# EAGLE design ethernet_poe (EAGLE 9.6.2)
REVISION: 1.0; TEAM: RoboRacing
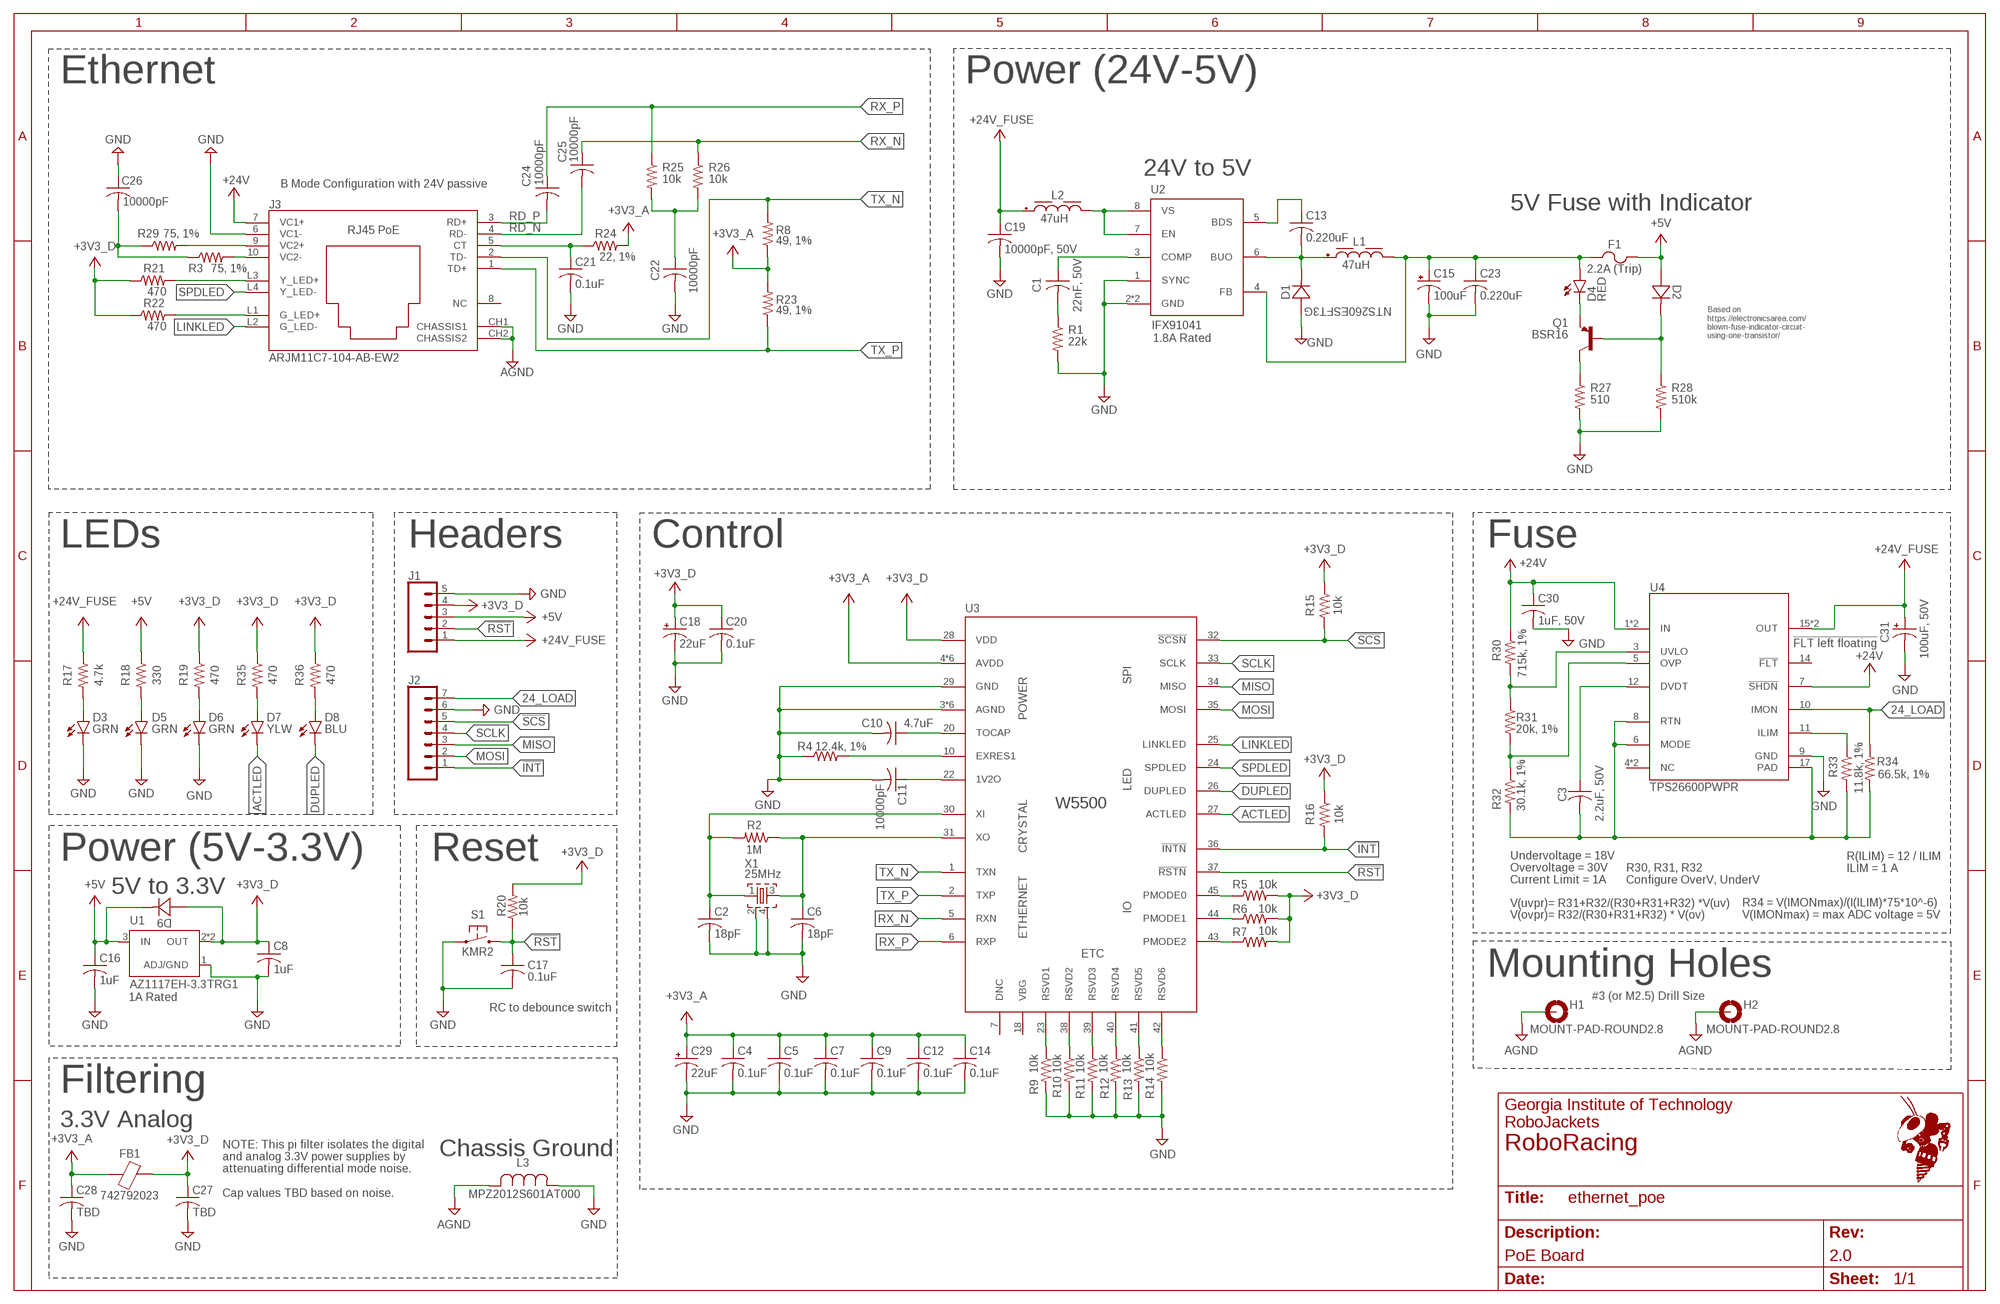
[diagram p0: schematic, sheet 1]
FRAME1 (FRAME_11_17): REVISION: 2.0; SCH_DESC: PoE Board; TEAM: RoboRacing

## Parts
C1  22nF, 50V  C-USC0603  [C0603]
C2  18pF  C-USC0603  [C0603]
C3  2.2uF, 50V  C-USC0603  [C0603]
C4  0.1uF  C-USC0402  [C0402]
C5  0.1uF  C-USC0402  [C0402]
C6  18pF  C-USC0603  [C0603]
C7  0.1uF  C-USC0402  [C0402]
C8  1uF  C-USC0603  [C0603]
C9  0.1uF  C-USC0402  [C0402]
C10  4.7uF  C-USC0603  [C0603]
C11  10000pF  C-USC0402  [C0402]
C12  0.1uF  C-USC0402  [C0402]
C13  0.220uF  C-USC0603  [C0603]
C14  0.1uF  C-USC0402  [C0402]
C15  100uF  CPOL-USE2-5  [E2-5]
C16  1uF  C-USC0603  [C0603]
C17  0.1uF  C-USC0603  [C0603]
C18  22uF  CPOL-USE2-5  [E2-5]
C19  10000pF, 50V  C-USC0603  [C0603]
C20  0.1uF  C-USC0603  [C0603]
C21  0.1uF  C-USC0603  [C0603]
C22  10000pF  C-USC0603  [C0603]
C23  0.220uF  C-USC0603  [C0603]
C24  10000pF  C-USC0402  [C0402]
C25  10000pF  C-USC0402  [C0402]
C26  10000pF  C-USC0603  [C0603]
C27  TBD  C-USC0603  [C0603]
C28  TBD  C-USC0603  [C0603]
C29  22uF  22UF-POLAR-PANASONIC_C-35V-20%  [PANASONIC_C]
C30  1uF, 50V  C-USC0603  [C0603]
C31  100uF, 50V  CPOL-USE2-5  [E2-5]
D1  NTS260ESFT3G  [DIO_SS26FL]
D2  1N4148W-7-F  [SOD123_DIO]
D3  GRN  LEDCHIP-LED0603  [CHIP-LED0603]
D4  RED  LEDCHIP-LED0603  [CHIP-LED0603]
D5  GRN  LEDCHIP-LED0603  [CHIP-LED0603]
D6  GRN  LEDCHIP-LED0603  [CHIP-LED0603]
D7  YLW  LEDCHIP-LED0603  [CHIP-LED0603]
D8  BLU  LEDCHIP-LED0603  [CHIP-LED0603]
D9  1N4148W-7-F  [SOD123_DIO]
F1  2.2A (Trip)  0ZCG0110AF2C  [0ZCG_BEL]
FB1  742792023  [0805]
H1  MOUNT-PAD-ROUND2.8  [2,8-PAD]
H2  MOUNT-PAD-ROUND2.8  [2,8-PAD]
J1  CONN_05  [1X05]
J2  CONN_07  [1X07]
J3  ARJM11C7-104-AB-EW2  [CONN_EW_ABR]
L1  47uH  WE-PD_1260_744771147  [WE-PD_1260]
L2  47uH  WE-PD_7345_744777147  [WE-PD_7345]
L3  MPZ2012S601AT000  [IND_2012_TDK]
Q1  BSR16  [SOT-23-3]
R1  22k  R-US_R0603  [R0603]
R2  1M  R-US_R0402  [R0402]
R3  75, 1%  R-US_R0603  [R0603]
R4  12.4k, 1%  R-US_R0603  [R0603]
R5  10k  R-US_R0603  [R0603]
R6  10k  R-US_R0603  [R0603]
R7  10k  R-US_R0603  [R0603]
R8  49, 1%  R-US_R0402  [R0402]
R9  10k  R-US_R0603  [R0603]
R10  10k  R-US_R0603  [R0603]
R11  10k  R-US_R0603  [R0603]
R12  10k  R-US_R0603  [R0603]
R13  10k  R-US_R0603  [R0603]
R14  10k  R-US_R0603  [R0603]
R15  10k  R-US_R0603  [R0603]
R16  10k  R-US_R0603  [R0603]
R17  4.7k  R-US_R0603  [R0603]
R18  330  R-US_R0603  [R0603]
R19  470  R-US_R0603  [R0603]
R20  10k  R-US_R0603  [R0603]
R21  470  R-US_R0603  [R0603]
R22  470  R-US_R0603  [R0603]
R23  49, 1%  R-US_R0402  [R0402]
R24  22, 1%  R-US_R0603  [R0603]
R25  10k  R-US_R0603  [R0603]
R26  10k  R-US_R0603  [R0603]
R27  510  R-US_R0603  [R0603]
R28  510k  R-US_R0603  [R0603]
R29  75, 1%  R-US_R0603  [R0603]
R30  715k, 1%  R-US_R0603  [R0603]
R31  20k, 1%  R-US_R0603  [R0603]
R32  30.1k, 1%  R-US_R0603  [R0603]
R33  11.8k, 1%  R-US_R0603  [R0603]
R34  66.5k, 1%  R-US_R0603  [R0603]
R35  470  R-US_R0603  [R0603]
R36  470  R-US_R0603  [R0603]
S1  KMR2  [KMR2]
U1  AZ1117EH-3.3TRG1  [SOT230P700X180-4N]
U2  IFX91041  [SOIC-8-EXPOSED_PAD]
U3  W5500  [48-LQFP]
U4  TPS26600PWPR  [PWP0016H_N]
X1  25MHz  ABM10-25.000MHZ-18-E30-T3  [OSCILLATOR-SMD-2.5X2]

## Nets
3V3_LED: D6.A R19.2
3V3_LED1: D7.A R35.2
3V3_LED2: D8.A R36.2
5V_LED: D5.A R18.2
5V_RAW: C13.2 D1.1 L1.1 U2.6(BUO)
24_LOAD: J2.7 R34.1 U4.10(IMON)
24V_LED: D3.A R17.2
!INT [spi]: J2.1 R16.2 U3.36(!INTN)
!RST: C17.1 J1.2 R20.1 S1.2.1 S1.2.2 U3.37(!RSTN)
!SCS [spi]: J2.5 R15.2 U3.32(!SCSN)
+3V3_A: C4.1 C5.1 C7.1 C9.1 C12.1 C14.1 C28.1 C29.+ FB1.1 R8.1 R23.2 R24.2 U3.4(AVDD) U3.8(AVDD) U3.11(AVDD) U3.15(AVDD) U3.17(AVDD) U3.21(AVDD)
+3V3_D [power]: C8.1 C18.+ C20.1 C27.1 D9.2 FB1.2 J1.4 R5.2 R6.2 R7.2 R15.1 R16.1 R19.1 R20.2 R21.1 R22.1 R35.1 R36.1 U1.2(OUT) U1.4(OUT) U3.28(VDD)
+5V: C16.1 D2.2 D9.1 F1.2 J1.3 R18.1 U1.3(IN)
+5V_PREFUSE: C15.+ C23.1 D4.A F1.1 L1.2 U2.4(FB)
+24V: C30.1 J3.7(VC1+) R30.1 U4.1(IN) U4.2(IN) U4.7(!SHDN)
+24V_FILTERED: L2.2 U2.7(EN) U2.8(VS)
+24V_FUSE: C19.1 C31.+ J1.1 L2.1 R17.1 U4.15(OUT) U4.16(OUT)
ACTLED: D7.C U3.27(ACTLED)
AGND: H1.B2,8(MOUNT) H2.B2,8(MOUNT) J3.CH1(CHASSIS1) J3.CH2(CHASSIS2) L3.2
CT: C21.1 J3.5(CT) R24.1
DUPLED: D8.C U3.26(DUPLED)
G_LED+: J3.L1(G_LED+) R22.2
GND [ethernet]: C2.2 C4.2 C5.2 C6.2 C7.2 C8.2 C9.2 C10.2 C11.2 C12.2 C14.2 C15.- C16.2 C17.2 C18.- C19.2 C20.2 C21.2 C22.2 C23.2 C26.1 C27.2 C28.2 C29.- C30.2 C31.- D1.2 D3.C D5.C D6.C J1.5 J2.6 J3.6(VC1-) L3.1 R1.2 R4.1 R9.2 R10.2 R11.2 R12.2 R13.2 R14.2 R27.2 R28.2 S1.1.1 S1.1.2 U1.1(ADJ/GND) U2.1(SYNC) U2.2(GND) U2.9(GND) U3.3(AGND) U3.9(AGND) U3.14(AGND) U3.16(AGND) U3.19(AGND) U3.29(GND) U3.48(AGND) U4.9(GND) X1.2(SHD1) X1.4(SHD2)
LINKLED: J3.L2(G_LED-) U3.25(LINKLED)
MISO [spi]: J2.3 U3.34(MISO)
MOSI [spi]: J2.2 U3.35(MOSI)
N$1: R9.1 U3.23(RSVD1)
N$2: R10.1 U3.38(RSVD2)
N$3: R11.1 U3.39(RSVD3)
N$4: R5.1 U3.45(PMODE0)
N$5: R6.1 U3.44(PMODE1)
N$6: R12.1 U3.40(RSVD4)
N$7: R7.1 U3.43(PMODE2)
N$8: J3.9(VC2+) R29.2
N$9: R30.2 R31.1 U4.3(UVLO)
N$10: J3.10(VC2-) R3.2
N$11: C6.1 R2.1 U3.31(XO) X1.3(OUT)
N$12: C26.2 R3.1 R29.1
N$13: C2.1 R2.2 U3.30(XI) X1.1(IN)
N$15: C13.1 U2.5(BDS)
N$16: C1.2 R1.1
N$17: C1.1 U2.3(COMP)
N$18: C11.1 U3.22(1V2O)
N$19: C10.1 U3.20(TOCAP)
N$20: R13.1 U3.41(RSVD5)
N$21: R4.2 U3.10(EXRES1)
N$22: R14.1 U3.42(RSVD6)
N$23: D4.C Q1.2(E)
N$24: D2.1 Q1.1(B) R28.1
N$25: Q1.3(C) R27.1
N$27: R31.2 R32.1 U4.5(OVP)
N$28: C3.1 U4.12(DVDT)
N$33 [power]: R33.1 U4.11(ILIM)
RD_N [ethernet]: C25.2 J3.4(RD-)
RD_P [ethernet]: C24.2 J3.3(RD+)
RTN: C3.2 R32.2 R33.2 R34.2 U4.6(MODE) U4.8(RTN) U4.17(PAD)
RX_FILTER: C22.1 R25.2 R26.2
RX_N [ethernet]: C25.1 R26.1 U3.5(RXN)
RX_P [ethernet]: C24.1 R25.1 U3.6(RXP)
SCLK [spi]: J2.4 U3.33(SCLK)
SPDLED: J3.L4(Y_LED-) U3.24(SPDLED)
TX_N [ethernet]: J3.2(TD-) R8.2 U3.1(TXN)
TX_P [ethernet]: J3.1(TD+) R23.1 U3.2(TXP)
Y_LED+: J3.L3(Y_LED+) R21.2
Unconnected: J3.8(NC) U3.7(DNC) U3.18(VBG) U4.4(NC) U4.13(NC) U4.14(!FLT)

## Notes on the sheet
- Ethernet | Power (24V-5V)
- 24V to 5V
- B Mode Configuration with 24V passive
- 5V Fuse with Indicator
- Based on
  https://electronicsarea.com/
  blown-fuse-indicator-circuit-
  using-one-transistor/
- 1.8A Rated
- LEDs | Headers | Control | Fuse
- !FLT left floating
- Power (5V-3.3V) | Reset
- R(ILIM) = 12 / ILIM
  ILIM = 1 A
- Undervoltage = 18V
  Overvoltage = 30V
  Current Limit = 1A
- R30, R31, R32 
  Configure OverV, UnderV
- 5V to 3.3V
- V(uvpr)= R31+R32/(R30+R31+R32) *V(uv)
- V(ovpr)= R32/(R30+R31+R32) * V(ov)
- R34 = V(IMONmax)/(I(ILIM)*75*10^-6)
  V(IMONmax) = max ADC voltage = 5V
- Mounting Holes
- 1A Rated | #3 (or M2.5) Drill Size
- RC to debounce switch
- Filtering
- 3.3V Analog
- Chassis Ground
- NOTE: This pi filter isolates the digital 
  and analog 3.3V power supplies by
  attenuating differential mode noise. 
  
  Cap values TBD based on noise.

## Library data of the parts
C1-C3 C6 C8 C10 C13 C16 C17 C19-C23 C26 C30 = rcl:C-US: CAPACITOR, American symbol; SPICEPREFIX: C
C4 C5 C7 C9 C11 C12 C14 C24 C25 C27 C28 = adafruit:C-US: CAPACITOR, American symbol
C15 C18 C31 = rcl:CPOL-US: POLARIZED CAPACITOR, American symbol; SPICEPREFIX: C
C29 = SparkFun-Capacitors:22UF-POLAR: 22µF polarized capacitors A capacitor is a passive two-terminal electrical component used to store electrical energy temporarily in an electric field.; PROD_ID: CAP-08618
D1 = ethernet_poe:NTS260ESFT3G
D2 D9 = ethernet_poe:1N4148W-7-F: Diode Standard 100V 300mA (DC) Surface Mount SOD-123; DKPN: 1N4148W-FDICT-ND
D3-D8 = led:LED: LED OSRAM: - CHIPLED LG R971, LG N971, LY N971, LG Q971, LY Q971, LO R971, LY R971 LH N974, LH R974 LS Q976, LO Q976, LY Q976 LO Q996 - Hyper CHIPLED LW Q18S LB Q993, LB Q99A, LB R99A - SideLED LS A670, LO A670, LY A670, LG A670, LP A670 LB A673, LV A673, LT A673, LW A673 LH A674 LY A675 LS A676, LA A676, LO A676, LY A676, LW A676 LS A679, LY A679, LG A679 - Hyper Micro SIDELED® LS Y876, LA Y876, LO Y876, LY Y876 LT Y87S - SmartLED LW L88C, LW L88S LB L89C, LB L89S, LG L890 LS L89K, LO L89K, LY L89K LS L896, LA L896, LO L896, LY L896 - TOPLED LS T670, LO T670, LY T670, LG T670, LP T670 LSG T670, LSP T670, LSY T670, LOP T670, LYG T670 LG T671, LOG T671, LSG T671 LB T673, LV T673, LT T673, LW T673 LH T674 LS T676, LA T676, LO T676, LY T676, LB T676, LH T676, LSB T676, LW T676 LB T67C, LV T67C, LT T67C, LS T67K, LO T67K, LY T67K, LW E67C LS E67B, LA E67B, LO E67B, LY E67B, LB E67C, LV E67C, LT E67C LW T67C LS T679, LY T679, LG T679 LS T770, LO T770, LY T770, LG T770, LP T770 LB T773, LV T773, LT T773, LW T773 LH T774 LS E675, LA E675, LY E675, LS T675 LS T776, LA T776, LO T776, LY T776, LB T776 LHGB T686 LT T68C, LB T68C - Hyper Mini TOPLED® LB M676 - Mini TOPLED Santana® LG M470 LS M47K, LO M47K, LY M47K Source: http://www.osram.convergy.de LUXEON: - LUMILED® LXK2-PW12-R00, LXK2-PW12-S00, LXK2-PW14-U00, LXK2-PW14-V00 LXK2-PM12-R00, LXK2-PM12-S00, LXK2-PM14-U00 LXK2-PE12-Q00, LXK2-PE12-R00, LXK2-PE12-S00, LXK2-PE14-T00, LXK2-PE14-U00 LXK2-PB12-K00, LXK2-PB12-L00, LXK2-PB12-M00, LXK2-PB14-N00, LXK2-PB14-P00, LXK2-PB14-Q00 LXK2-PR12-L00, LXK2-PR12-M00, LXK2-PR14-Q00, LXK2-PR14-R00 LXK2-PD12-Q00, LXK2-PD12-R00, LXK2-PD12-S00 LXK2-PH12-R00, LXK2-PH12-S00 LXK2-PL12-P00, LXK2-PL12-Q00, LXK2-PL12-R00 Source: www.luxeon.com KINGBRIGHT: KA-3528ASYC Source: www.kingbright.com
F1 = ethernet_poe:0ZCG0110AF2C: Polymeric PTC Resettable Fuse 16V 2.2A Current Trip, 1.1A Current Hold Surface Mount 1812 (4532 Metric), Concave; DKPN: 507-1767-1-ND
FB1 = ethernet_poe:742792023: 120 Ohms @ 100MHz 1 Signal Line Ferrite Bead 0805 (2012 Metric) 3A 30mOhm; DKPN: 732-1613-1-ND
H1 H2 = holes:MOUNT-PAD-ROUND: MOUNTING PAD, round
J1 = SparkFun-Connectors:CONN_05: Multi connection point. Often used as Generic Header-pin footprint for 0.1 inch spaced/style header connections On any of the 0.1 inch spaced packages, you can populate with these: Break Away Headers - Straight <https://www.sparkfun.com/products/116> (PRT-00116) Break Away Male Headers - Right Angle <https://www.sparkfun.com/products/553> (PRT-00553) Female Headers <https://www.sparkfun.com/products/115> (PRT-00115) Break Away Headers - Machine Pin <https://www.sparkfun.com/products/117> (PRT-00117) Break Away Female Headers - Swiss Machine Pin <https://www.sparkfun.com/products/743> (PRT-00743) For SCREWTERMINALS and SPRING TERMINALS visit here: Screw Terimnals on SparkFun.com <https://www.sparkfun.com/search/results?term=Screw+Terminals> (5mm/3.5mm/2.54mm spacing) This device is also useful as a general connection point to wire up your design to another part of your project. Our various solder wires solder well into these plated through hole pads. Hook-Up Wire - Assortment (Stranded, 22 AWG) <https://www.sparkfun.com/products/11375> (PRT-11375) Hook-Up Wire - Assortment (Solid Core, 22 AWG) <https://www.sparkfun.com/products/11367> (PRT-11367) View the entire wire category on our website here <https://www.sparkfun.com/categories/141> Special notes: Molex polarized connector foot print use with SKU : PRT-08231 with associated crimp pins and housings. 1MM SMD Version SKU: PRT-10208
J2 = SparkFun-Connectors:CONN_07: Multi connection point. Often used as Generic Header-pin footprint for 0.1 inch spaced/style header connections On any of the 0.1 inch spaced packages, you can populate with these: Break Away Headers - Straight <https://www.sparkfun.com/products/116> (PRT-00116) Break Away Male Headers - Right Angle <https://www.sparkfun.com/products/553> (PRT-00553) Female Headers <https://www.sparkfun.com/products/115> (PRT-00115) Break Away Headers - Machine Pin <https://www.sparkfun.com/products/117> (PRT-00117) Break Away Female Headers - Swiss Machine Pin <https://www.sparkfun.com/products/743> (PRT-00743) For SCREWTERMINALS and SPRING TERMINALS visit here: Screw Terimnals on SparkFun.com <https://www.sparkfun.com/search/results?term=Screw+Terminals> (5mm/3.5mm/2.54mm spacing) This device is also useful as a general connection point to wire up your design to another part of your project. Our various solder wires solder well into these plated through hole pads. Hook-Up Wire - Assortment (Stranded, 22 AWG) <https://www.sparkfun.com/products/11375> (PRT-11375) Hook-Up Wire - Assortment (Solid Core, 22 AWG) <https://www.sparkfun.com/products/11367> (PRT-11367) View the entire wire category on our website here <https://www.sparkfun.com/categories/141> Special notes: Molex polarized connector foot print use with SKU : PRT-08231 with associated crimp pins and housings. 1MM SMD Version SKU: PRT-10208 NOTES ON THE VARIANTS LOCK and LOCK_LONGPADS... This footprint was designed to help hold the alignment of a through-hole component (i.e. 6-pin header) while soldering it into place. You may notice that each hole has been shifted either up or down by 0.005 of an inch from it's more standard position (which is a perfectly straight line). This slight alteration caused the pins (the squares in the middle) to touch the edges of the holes. Because they are alternating, it causes a "brace" to hold the component in place. 0.005 has proven to be the perfect amount of "off-center" position when using our standard breakaway headers. Although looks a little odd when you look at the bare footprint, once you have a header in there, the alteration is very hard to notice. Also,if you push a header all the way into place, it is covered up entirely on the bottom side.
J3 = ethernet_poe:ARJM11C7-104-AB-EW2: 1 Port RJ45 Magjack Connector Through Hole 10/100 Base-T, AutoMDIX, Power over Ethernet (PoE); DKPN: 535-14148-ND
L1 = Wurth_Electronic_Inductors:WE-PD_1260: WE-PD SMT Power Inductor Characteristics AECQ 200 Qualified Ultra low RDC and RAC Highest possible saturation current based on Ferrite Suitable for switching frequency up to 10MHz Temperature dependent parameter available on Redexpert Operating Temperature from -40°C to +125°C / +150°C Types WE-PD: Since always with low loss material, tight tolerances and high saturation behavior compared to other manufacturers in the market WE-PD Robust: Plastic base improves the mechanical stability and efficiency WE-PD Performance: MnZn core improves Saturation and RDC for highest efficiency Applications Switch Mode Power supplies from 0,1W up to 300W Integrated DC DC Converter Ideal for Switch Mode Power supplies with extreme high efficiency (>95%) <https://katalog.we-online.com/media/images/v2/o14825v209%20Family_WE-PD.jpg> Details see: https://katalog.we-online.com/en/pbs/WE-PD Updated by Yingchun,Shan 2019-07-25 2019 (C) Wurth Elektronik; DATASHEET-URL: https://www.we-online.com/catalog/datasheet/744771147.pdf; FRES: 9.2MHz; IR: 2.21A; ISAT: 2.6A; MOUNT: SMT; PART-NUMBER: 744771147; RDC-MAX: 75mOhm; RDC-TYP: 72mOhm; VERSION: Standard
L2 = Wurth_Electronic_Inductors:WE-PD_7345: WE-PD SMT Power Inductor Characteristics AECQ 200 Qualified Ultra low RDC and RAC Highest possible saturation current based on Ferrite Suitable for switching frequency up to 10MHz Temperature dependent parameter available on Redexpert Operating Temperature from -40°C to +125°C / +150°C Types WE-PD: Since always with low loss material, tight tolerances and high saturation behavior compared to other manufacturers in the market WE-PD Robust: Plastic base improves the mechanical stability and efficiency WE-PD Performance: MnZn core improves Saturation and RDC for highest efficiency Applications Switch Mode Power supplies from 0,1W up to 300W Integrated DC DC Converter Ideal for Switch Mode Power supplies with extreme high efficiency (>95%) <https://katalog.we-online.com/media/images/v2/o14825v209%20Family_WE-PD.jpg> Details see: https://katalog.we-online.com/en/pbs/WE-PD Updated by Yingchun,Shan 2019-07-25 2019 (C) Wurth Elektronik; DATASHEET-URL: https://www.we-online.com/catalog/datasheet/744777147.pdf; FRES: 10.5MHz; IR: 1.03A; ISAT: 1.1A; MOUNT: SMT; PART-NUMBER: 744777147; RDC-MAX: 260mOhm; RDC-TYP: 170mOhm; VERSION: Standard
L3 = POE:MPZ2012S601AT000; BUILT_BY: EMA_UL_Team; MANUFACTURER_PART_NUMBER: MPZ2012S601AT000; SOURCELIBRARY: TDK_2015_05_22; VENDOR: TDK
Q1 = ethernet_poe:BSR16: Bipolar (BJT) Transistor PNP 60V 800mA 200MHz 350mW Surface Mount SOT-23-3; DKPN: BSR16CT-ND
R1 R3-R7 R9-R22 R24-R36 = rcl:R-US_: RESISTOR, American symbol; SPICEPREFIX: R
R2 R8 R23 = adafruit:R-US_: RESISTOR, American symbol
S1 = RoboJackets-Switches:KMR2; FUNCTION: Reset
U1 = ethernet_poe:AZ1117EH-3.3TRG1: LDO Voltage Regulator 3.3V, 1A, Sot223; DKPN: AZ1117EH-3.3TRG1DICT-ND
U2 = ethernet_poe:IFX91041: 1.8A DC/DC Step-Down Voltage Regulator 5.0V, 3.3V, or Adjustable Output; DKPN: IFX91041EJV50XUMA1CT-ND
U3 = ethernet_poe:W5500: Chip to control 10/100 Ethernet and output data over SPI; DKPN: 1278-1021-ND
U4 = ethernet_poe:TPS26600PWPR; DKPN: 296-47292-1-ND
X1 = ethernet_poe:ABM10-25.000MHZ-18-E30-T3

## Net classes
0 default: width 0.203 mm, drill 0.4 mm, clearance 0.203 mm
1 power: width 0.203 mm, drill 0.4 mm, clearance 0.203 mm to class 0, clearance 0.203 mm
2 ethernet: width 0.16 mm, drill 0.3 mm, clearance 0.152 mm
3 spi: width 0.207 mm, drill 0.35 mm

## Board
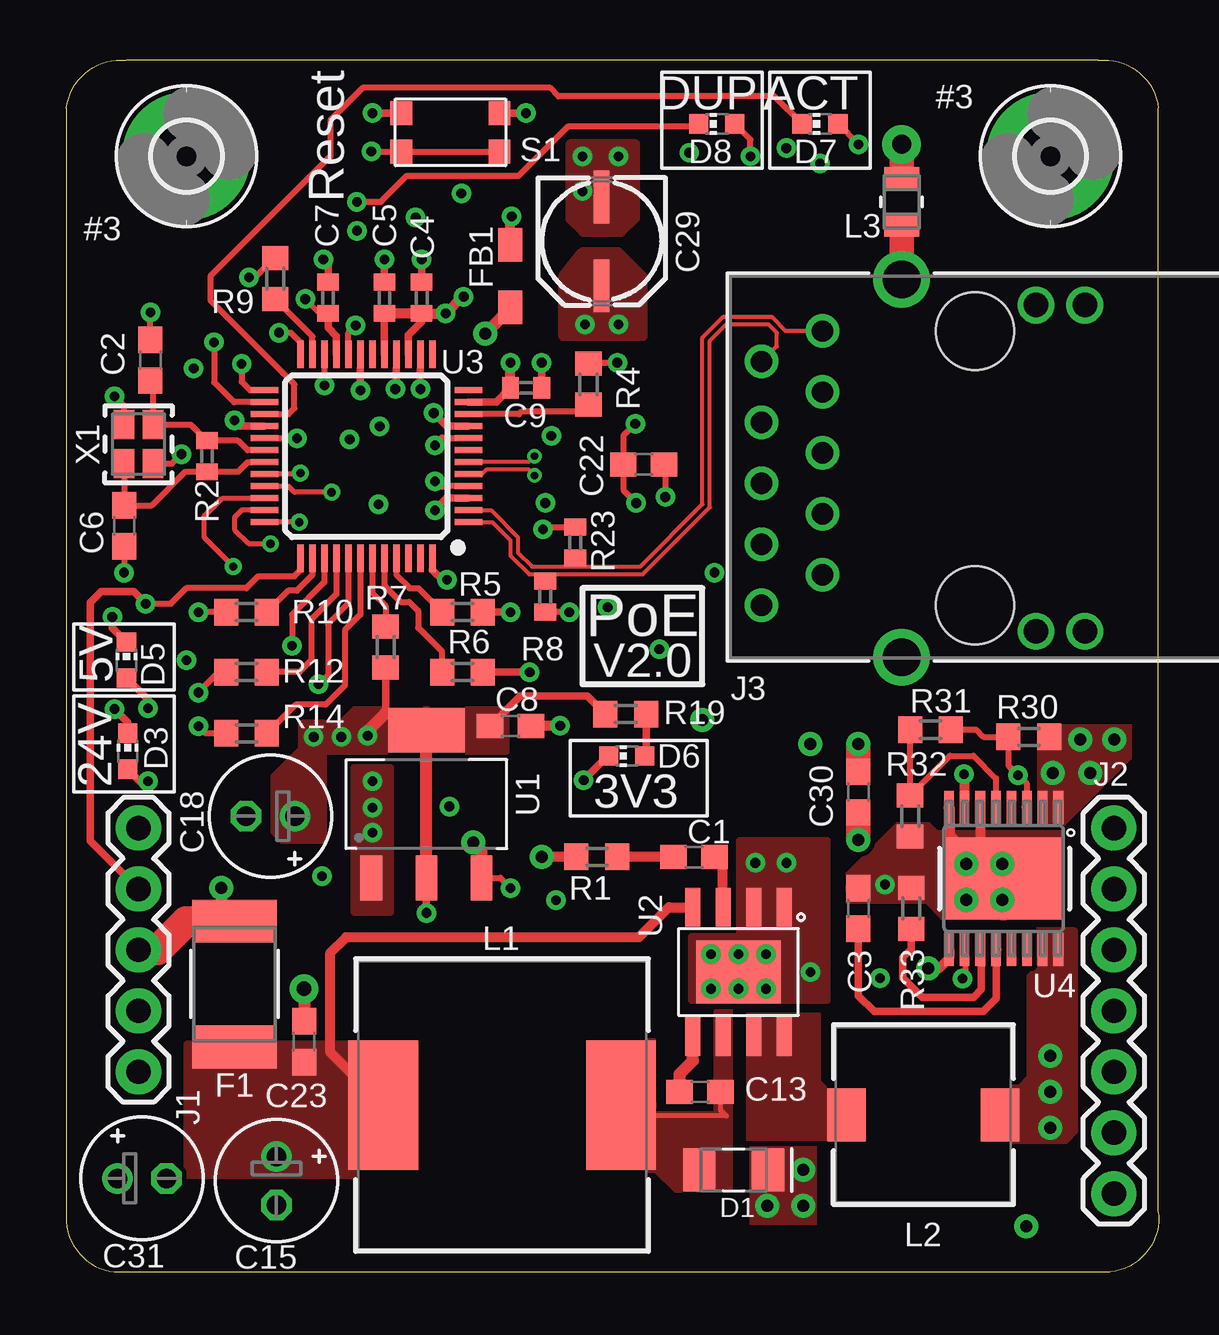
[diagram p1: board, top side]
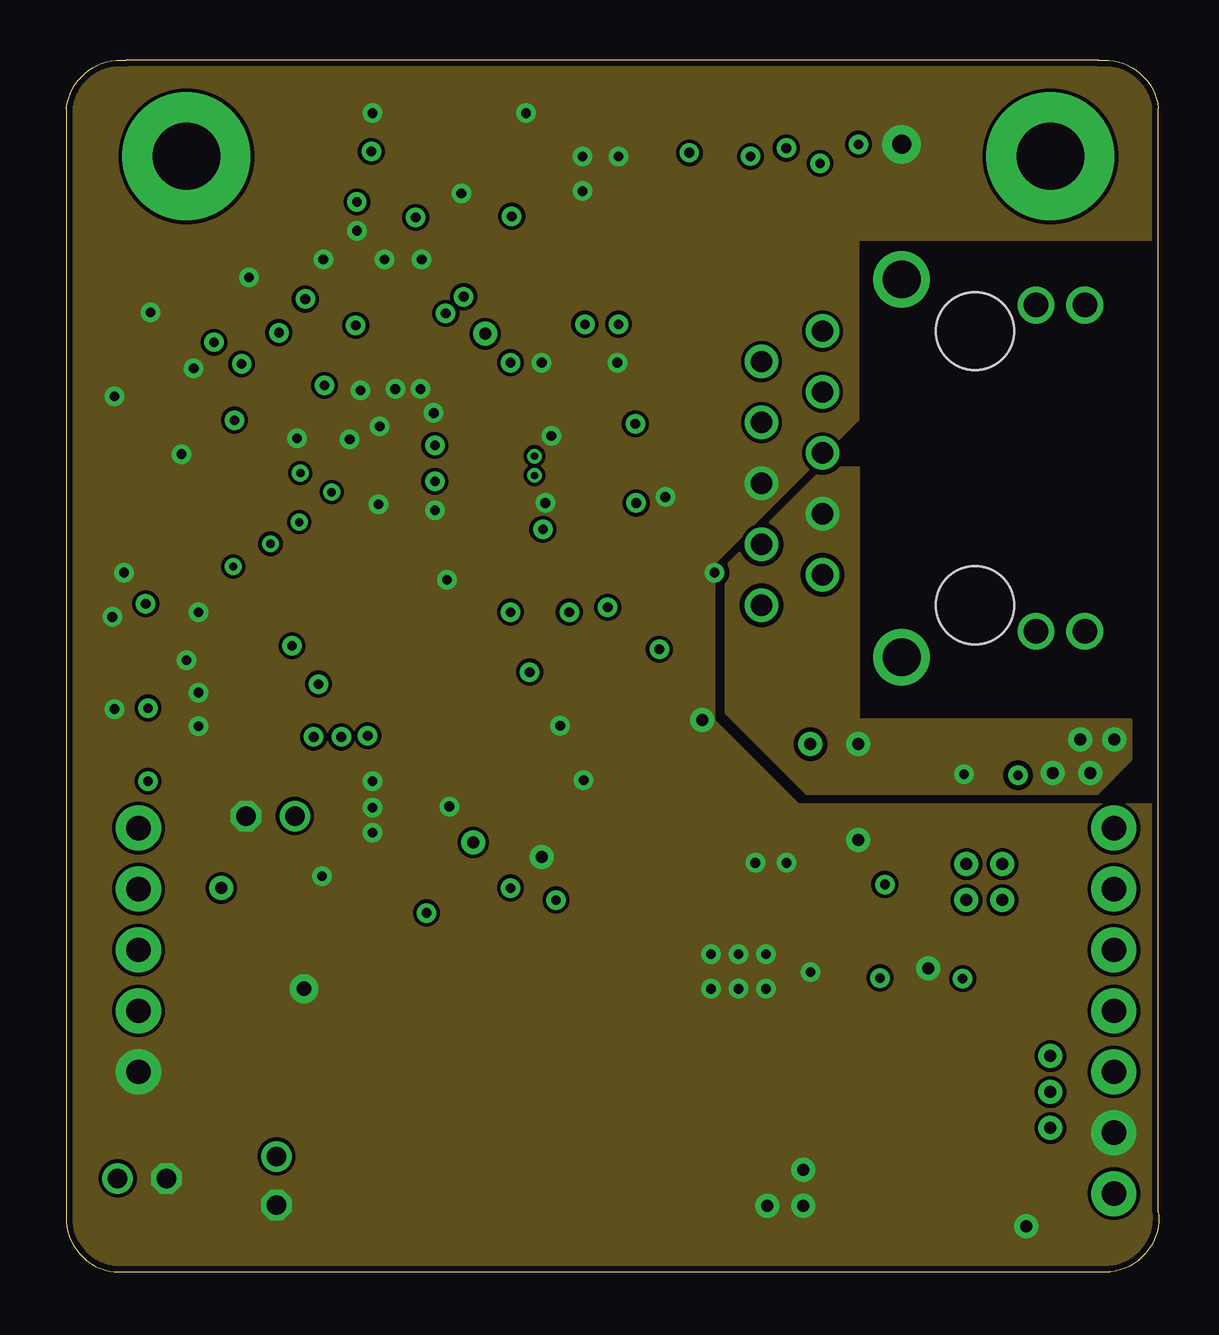
[diagram p2: board, inner layer GND]
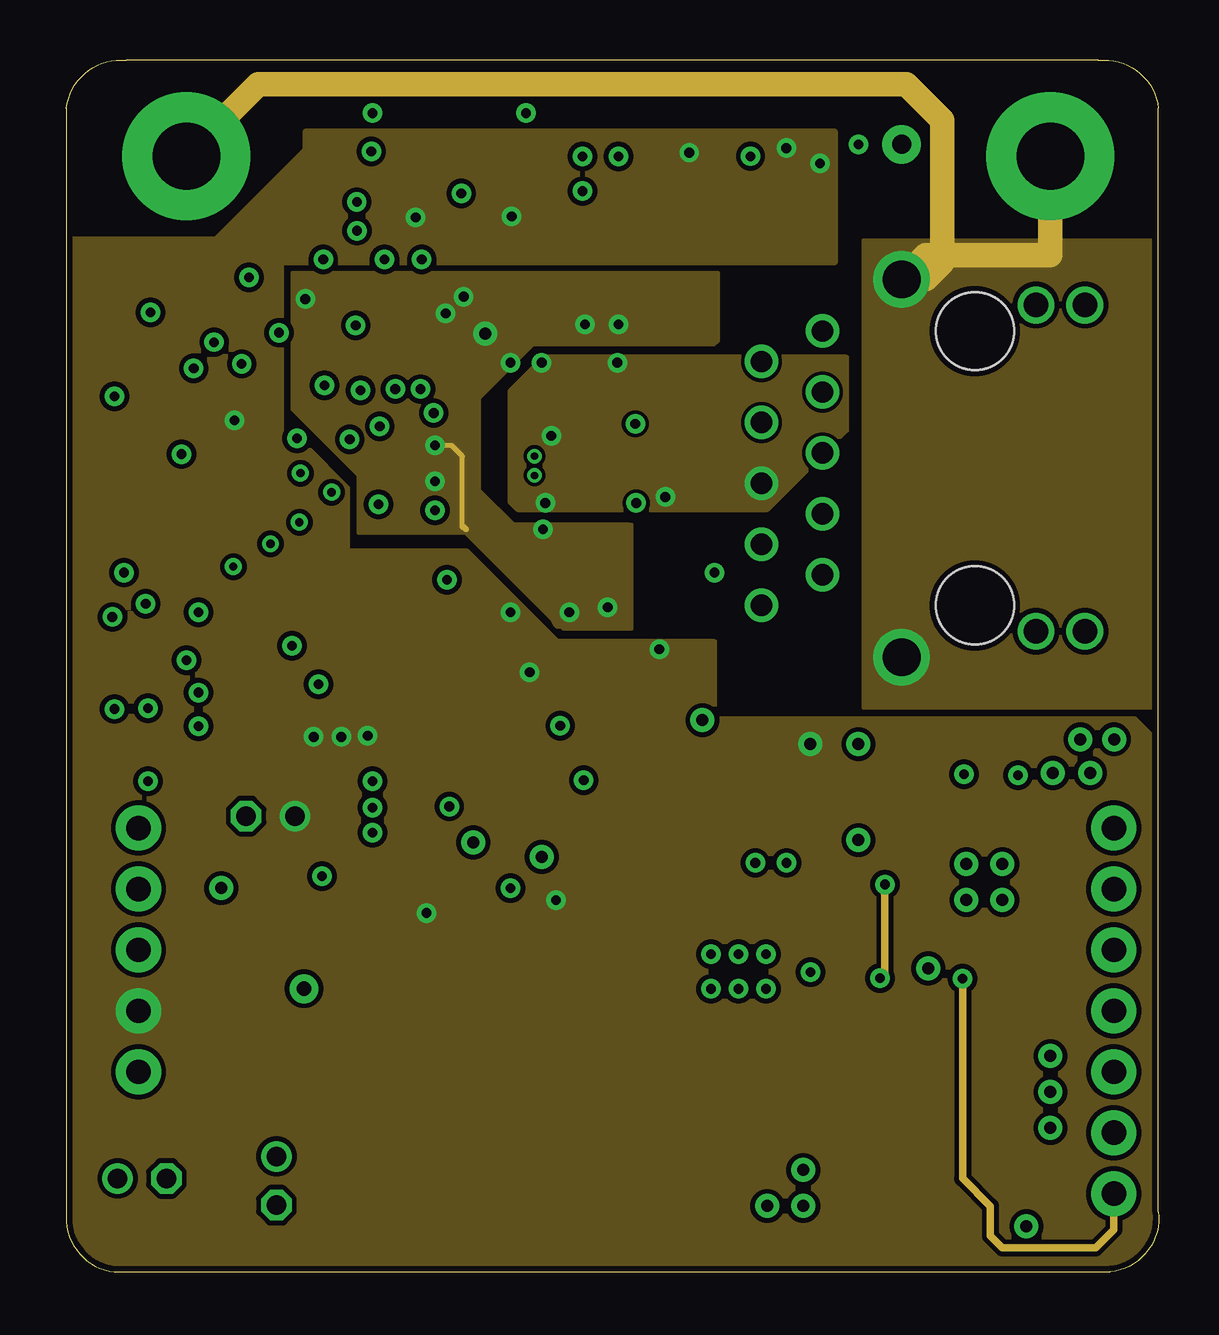
[diagram p3: board, inner layer PWR]
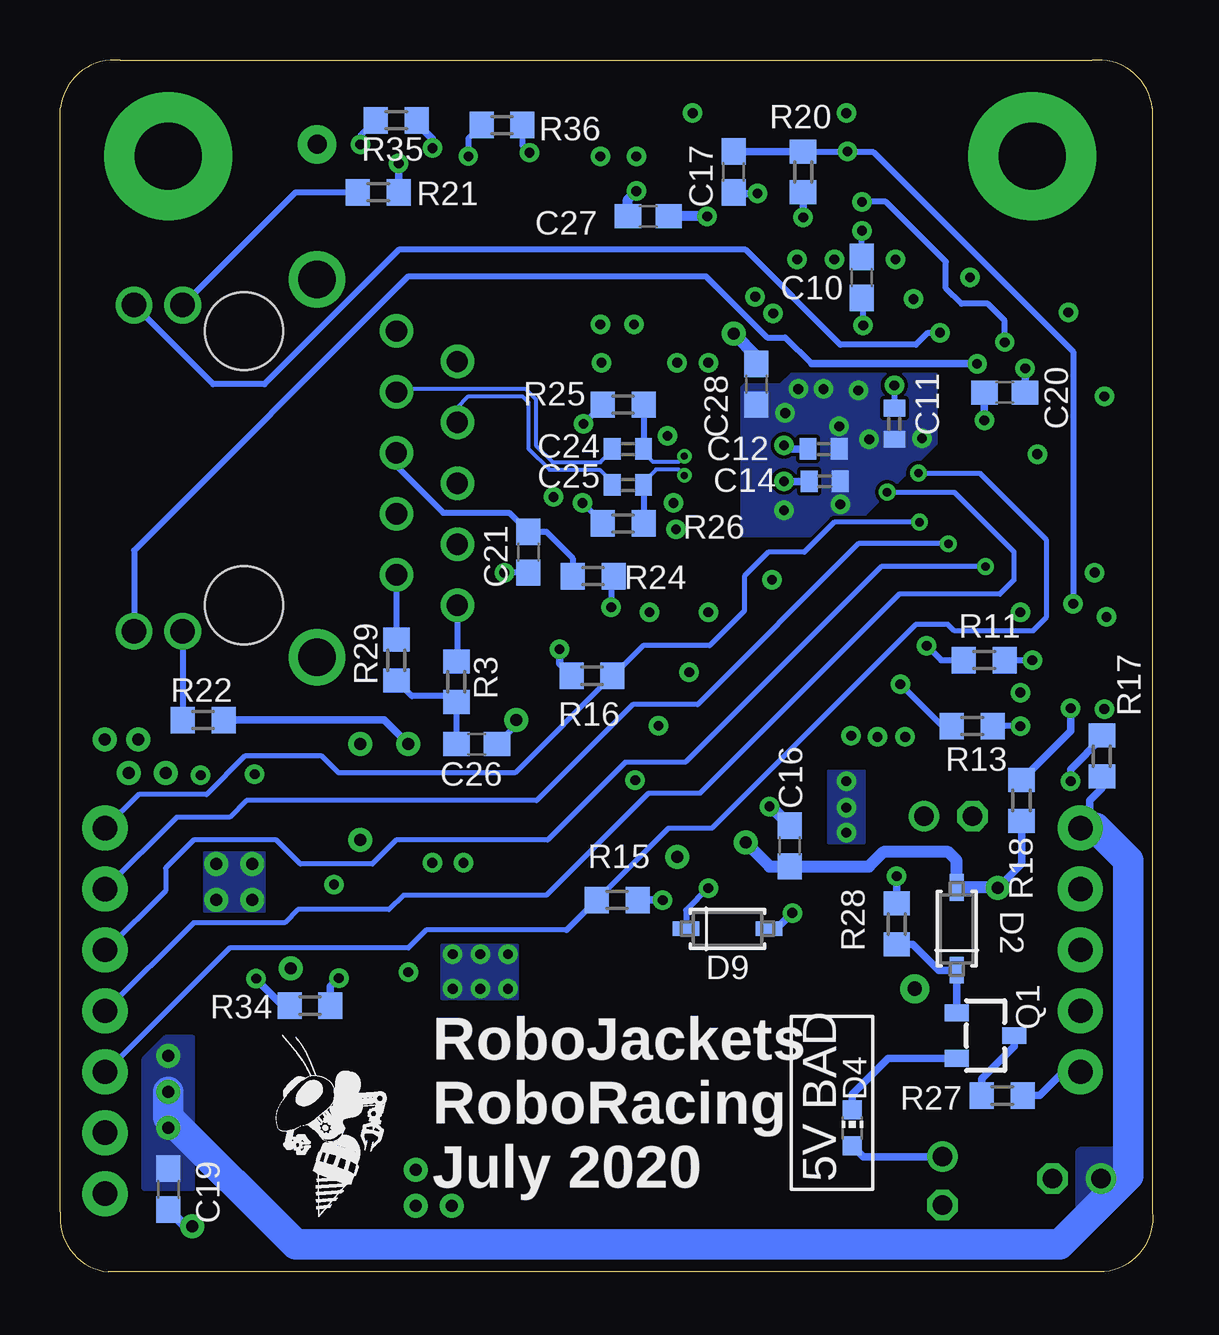
[diagram p4: board, bottom side, seen from below]

Size 45.53 x 50.51 mm. Coordinates in mm from the lower left corner, seen from the top.
Outline: 2.01,0 43.51,0 arc90 45.51,2.5 45.51,48.5 arc90 43.01,50.5 2.51,50.5 arc90 0.01,48.5 0.01,2.5 arc90 2.01,0
Copper layers (1+2*15+16): Top 0.035mm / dielectric 0.122mm / GND 0.035mm / dielectric 1.15mm / PWR 0.035mm / dielectric 0.122mm / Bottom 0.035mm
Design rules "4-Layer-DRC *": minimum track width 0.1mm, minimum drill 0.3mm, track to track 6mil, track to pad 6mil, pad to pad 6mil, via to via 6mil, smd to smd 0mil, copper to edge 0.25mm, drill to drill 0.4mm, minimum pad ring 0.175mm, minimum via ring 0.125mm, stop-mask expansion 0mil, vias tented up to drill 1.5mm, thermal gap 0mil

### Footprints (pad centres in the part's own frame; a part is rotated, then mirrored left to right if it is on the bottom)
C0603 = smd 1.1 x 1: 1 -0.85,0; 2 0.85,0
C0402 = smd 0.7 x 0.9: 1 -0.65,0; 2 0.65,0
E2-5 = drill 0.813 pad 1.27: + -1.016,0 | drill 0.813 pad 1.27 octagon: - 1.016,0
PANASONIC_C = smd 2.2 x 0.65: + 1.9,-0.2; - -1.8,-0.2
DIO_SS26FL = smd 1.34 x 1.8: 1 -1.43,0; 2 1.43,0
SOD123_DIO = smd 1.111 x 0.601: 1 -1.725,0; 2 1.725,0
CHIP-LED0603 = smd 0.8 x 0.8: A 0,-0.75; C 0,0.75
0ZCG_BEL = smd 1.778 x 3.505: 1 -2.616,0; 2 2.616,0
0805 = smd 1.4 x 1: 1 -1.3,0; 2 1.3,0
2,8-PAD = drill 2.8 pad 5.334: B2,8 0,0
1X05 = drill 1.016 pad 1.88: 1 0,0; 2 2.54,0; 3 5.08,0; 4 7.62,0; 5 10.16,0
1X07 = drill 1.016 pad 1.88: 1 0,0; 2 2.54,0; 3 5.08,0; 4 7.62,0; 5 10.16,0; 6 12.7,0; 7 15.24,0
CONN_EW_ABR = drill 0.89 pad 1.397: 1 5.715,0; 2 4.445,2.54; 3 3.175,0; 4 1.905,2.54; 6 -0.635,2.54; 7 -1.905,0; 8 -3.175,2.54; 9 -4.445,0; 10 -5.715,2.54 | drill 0.889 pad 1.397: 5 0.635,0 | drill 1.57 pad 2.083: CH1 -7.875,-3.3; CH2 7.875,-3.3 | drill 1.02 pad 1.524: L1 -6.8,-8.9; L2 -6.8,-10.93; L3 6.8,-8.9; L4 6.8,-10.93 | hole 3.25: 5.715,-6.35; -5.715,-6.35
WE-PD_1260 = smd 2.9 x 5.4: 1 -4.95,0; 2 4.95,0
WE-PD_7345 = smd 1.6 x 2.2: 1 -3.2,0; 2 3.2,0
IND_2012_TDK = smd 0.956 x 1.45: 1 -0.978,0; 2 0.978,0
SOT-23-3 = smd 0.7 x 1: 1 -0.95,-1.2; 2 0.95,-1.2; 3 0,1.2
R0603 = smd 1 x 1.1: 1 -0.85,0; 2 0.85,0
R0402 = smd 0.7 x 0.9: 1 -0.65,0; 2 0.65,0
KMR2 = smd 0.9 x 1: 1.1 -2.05,0.8; 1.2 2.05,0.8; 2.1 -2.05,-0.8; 2.2 2.05,-0.8
SOT230P700X180-4N = smd 1.86 x 0.9: 1 -3.075,2.3; 2 -3.075,0; 3 -3.075,-2.3 | smd 1.86 x 3.19: 4 3.075,0
SOIC-8-EXPOSED_PAD = smd 1.6 x 0.61: 1 -2.7,1.905; 2 -2.7,0.635; 3 -2.7,-0.635; 4 -2.7,-1.905; 5 2.7,-1.905; 6 2.7,-0.635; 7 2.7,0.635; 8 2.7,1.905 | smd 2.62 x 3.51: 9 0,0
48-LQFP = smd 1.143 x 0.254: 1 -4.25,2.75; 2 -4.25,2.25; 3 -4.25,1.75; 4 -4.25,1.25; 5 -4.25,0.75; 6 -4.25,0.25; 7 -4.25,-0.25; 8 -4.25,-0.75; 9 -4.25,-1.25; 10 -4.25,-1.75; 11 -4.25,-2.25; 12 -4.25,-2.75; 25 4.25,-2.75; 26 4.25,-2.25; 27 4.25,-1.75; 28 4.25,-1.25; 29 4.25,-0.75; 30 4.25,-0.25; 31 4.25,0.25; 32 4.25,0.75; 33 4.25,1.25; 34 4.25,1.75; 35 4.25,2.25; 36 4.25,2.75 | smd 0.254 x 1.143: 13 -2.75,-4.25; 14 -2.25,-4.25; 15 -1.75,-4.25; 16 -1.25,-4.25; 17 -0.75,-4.25; 18 -0.25,-4.25; 19 0.25,-4.25; 20 0.75,-4.25; 21 1.25,-4.25; 22 1.75,-4.25; 23 2.25,-4.25; 24 2.75,-4.25; 37 2.75,4.25; 38 2.25,4.25; 39 1.75,4.25; 40 1.25,4.25; 41 0.75,4.25; 42 0.25,4.25; 43 -0.25,4.25; 44 -0.75,4.25; 45 -1.25,4.25; 46 -1.75,4.25; 47 -2.25,4.25; 48 -2.75,4.25
PWP0016H_N = smd 1.4 x 0.4: 1 -2.95,2.275; 2 -2.95,1.625; 3 -2.95,0.975; 4 -2.95,0.325; 5 -2.95,-0.325; 6 -2.95,-0.975; 7 -2.95,-1.625; 8 -2.95,-2.275; 9 2.95,-2.275; 10 2.95,-1.625; 11 2.95,-0.975; 12 2.95,-0.325; 13 2.95,0.325; 14 2.95,0.975; 15 2.95,1.625; 16 2.95,2.275 | smd 3.4 x 5: 17 0,0
OSCILLATOR-SMD-2.5X2 = smd 1.2 x 0.85: 1 -0.812,0.6; 2 0.812,0.6; 3 0.812,-0.6; 4 -0.812,-0.6

### Placement (x,y rotation side)
C1  26.16,17.3 180 top
C2  3.51,38 90 top
C3  33.01,15.15 90 top
C4  14.81,40.6 90 top
C5  13.26,40.6 90 top
C6  2.41,31.1 270 top
C7  10.91,40.6 90 top
C8  18.51,22.75 0 top
C9  19.16,36.85 0 top
C10  12.11,41.45 90 bottom
C11  10.76,35.35 270 bottom
C12  13.71,34.3 0 bottom
C13  26.41,7.5 0 top
C14  13.66,32.95 0 bottom
C15  8.76,3.8 270 top
C16  15.11,17.75 90 bottom
C17  17.46,45.85 270 bottom
C18  8.51,19 180 top
C19  41.01,3.45 270 bottom
C20  6.16,36.65 0 bottom
C21  26.01,30 270 bottom
C22  24.06,33.65 0 top
C23  9.91,9.6 90 top
C24  21.86,34.3 180 bottom
C25  21.86,32.8 180 bottom
C26  28.16,22 180 bottom
C27  21.01,44 180 bottom
C28  16.51,37 270 bottom
C29  22.51,43 270 top
C30  33.01,20 270 top
C31  100uF, 35V  [E2-5]  3.16,3.9 0 top
D1  27.81,4.25 0 top
D2  8.16,14.3 90 bottom
D3  2.56,21.7 0 top
D4  12.51,6 0 bottom
D5  2.51,25.5 0 top
D6  23.36,21.5 90 top
D7  31.41,47.85 90 top
D8  27.11,47.85 90 top
D9  17.71,14.3 0 bottom
F1  7.01,12 90 top
FB1  18.51,41.5 90 top
H1  5.01,46.5 0 top
H2  41.01,46.5 0 top
J1  3.01,18.5 270 top
J2  43.65,18.5 270 top
J3  31.51,33.5 90 top
L1  18.16,6.95 180 top
L2  35.71,6.55 180 top
L3  34.81,44.6 270 top
Q1  6.96,9.85 270 bottom
R1  22.11,17.3 180 top
R2  5.86,34 90 top
R3  29.01,24.6 90 bottom
R4  21.76,37 270 top
R5  16.51,27.5 0 top
R6  16.51,25 0 top
R7  13.31,26.05 270 top
R8  49.9, 1%  [R0402]  19.96,28.15 90 top
R9  8.71,41.4 90 top
R10  7.51,27.5 180 top
R11  7.01,25.5 0 bottom
R12  7.51,25 180 top
R13  7.51,22.75 0 bottom
R14  7.51,22.45 180 top
R15  22.31,15.5 180 bottom
R16  23.36,24.85 0 bottom
R17  2.11,21.5 90 bottom
R18  5.46,19.65 90 bottom
R19  23.31,23.25 0 top
R20  14.56,45.85 270 bottom
R21  32.26,45 180 bottom
R22  39.56,23 180 bottom
R23  49.9, 1%  [R0402]  21.21,30.4 90 top
R24  23.31,29 0 bottom
R25  22.06,36.15 180 bottom
R26  22.06,31.2 180 bottom
R27  6.26,7.35 0 bottom
R28  10.66,14.5 90 bottom
R29  31.51,25.5 90 bottom
R30  40.11,22.3 180 top
R31  36.01,22.6 180 top
R32  35.16,19 270 top
R33  35.21,15.15 90 top
R34  35.11,11.1 0 bottom
R35  31.51,48 180 bottom
R36  27.11,47.8 180 bottom
S1  16.01,47.5 0 top
U1  15.01,19.5 90 top
U2  28.01,12.5 270 top
U3  12.51,34 180 top
U4  39.06,16.4 270 top
U$2  [ROBOBUZZ_0.4X]  34.76,2.3 0 bottom
X1  3.01,34.5 270 top

### Tracks (layer width: path | path; a pad name or v marks a point on that pad's centre or on a via)
3V3_LED
  Top 0.305: R19.2 24.16,21.55 D6.A
3V3_LED1  (via drill 0.41)
  Top 0.254: v33.01,47 D7.A
  Bottom 0.254: R35.2 33.01,47.35 v33.01,47
3V3_LED2  (via drill 0.4)
  Top 0.254: v28.51,46.5 28.51,47.2 D8.A
  Bottom 0.254: R36.2 28.51,47.25 v28.51,46.5
5V_LED  (via drill 0.41)
  Top 0.305: v3.41,23.5 3.41,23.85 D5.A
  Bottom 0.305: R18.2 3.41,22.55 v3.41,23.5
5V_RAW
  Top 0.203: C13.2 27.26,6.75 27.51,6.5 23.56,6.5 L1.1
  pour Top: 21.51,9.5 21.51,4.3 21.61,4.2 24.51,4.2 25.36,3.35 27.76,3.35 27.76,10.9 27.06,10.9 27.01,10.85 27.01,6.65 24.61,6.65 24.56,6.7 24.56,9.65 24.51,9.7 21.56,9.7 21.46,9.6
24_LOAD  (via drill 0.41)
  Top 0.254: U4.10 37.45,13.44 37.45,12.33 37.35,12.33 v37.35,12.23
  PWR 0.305: v37.35,12.23 37.35,3.9 38.51,2.74 38.51,1.5 39.01,1 42.89,1 43.65,1.76 J2.7
  Bottom 0.305: R34.1 36.26,11.1 37.35,12.19 v37.35,12.23
24V_LED  (via drill 0.41)
  Top 0.305: v3.41,20.45 3.06,20.45 D3.A
  Bottom 0.305: R17.2 2.11,22.25 3.41,20.95 v3.41,20.45
!INT  (via drill 0.35)
  Top 0.207: v9.71,31.25 U3.36
  Bottom 0.207: v9.71,31.25 13.26,31.25 14.51,30 16.01,30 17.01,29 17.01,27.55 18.46,26.1 21.23,26.1 22.48,24.85 | J2.1 42.25,19.9 39.42,19.9 37.82,21.5 34.61,21.5 33.91,20.8 26.56,20.8 R16.2
  Bottom 0.254: 22.48,24.85 R16.2
!RST  (via drill 0.41)
  Top 0.254: S1.2.2 S1.2.1 v12.71,46.7 | v3.31,27.85 4.36,27.85 5.01,28.5 7.51,28.5 8.01,29 9.51,29 9.76,29.25 U3.37
  Top 0.305: J1.2 1.01,17.96 1.01,27.9 1.46,28.35 2.81,28.35 v3.31,27.85
  Bottom 0.254: R20.1 v12.71,46.7 12.71,46.66 11.63,46.66 3.31,38.35 v3.31,27.85
  Bottom 0.305: R20.1 C17.1
!SCS  (via drill 0.35)
  Top 0.207: U3.32 9.71,33.25 v9.76,33.3
  Bottom 0.207: R15.2 20.16,18.5 18.36,18.5 9.87,26.99 8.53,26.99 8.27,26.72 4.99,26.72 4.41,27.3 4.41,30.5 7.21,33.3 v9.76,33.3 | J2.5 43.62,8.34 38.46,13.5 31.01,13.5 30.26,14.25 24.41,14.25
  Bottom 0.254: R15.2 24.41,14.25
+3V3_A  (via drill 0.41, 0.5)
  Top 0.203: C7.1 10.56,39.95 v9.96,40.55
  Top 0.254: 15.66,34.75 U3.8 | v19.86,30.95 19.96,31.05 R23.2 | v20.96,27.5 R8.1 | U3.4 15.66,32.75
  Top 0.305: U3.15 14.26,39.05 14.81,39.6 C4.1 | U3.17 C5.1 | U3.21 11.26,39 10.91,39.35 C7.1 | U3.11 17.91,36.25 C9.1 | v15.36,34.45 15.66,34.75 | 15.66,32.75 v15.36,32.95
  Top 0.406: C5.1 C4.1 v15.81,39.95 16.51,40.65 | C9.1 v18.51,37.9 | FB1.1 18.51,40.15 | 22.31,40.3 C29.+ 22.31,40.2
  Top 0.508: 16.51,40.65 v16.56,40.65 | 18.51,40.15 v17.46,39.1
  PWR 0.203: 16.51,31.05 16.51,34 16.06,34.45 v15.36,34.45
  PWR 0.254: 16.51,31.05 16.56,31.05 16.66,30.95
  Bottom 0.254: R24.2 22.56,28.9 v22.56,27.7
  Bottom 0.305: v15.36,34.45 15.21,34.3 C12.1 | v15.36,32.95 C14.1
  Bottom 0.406: 16.51,38.15 C28.1
  Bottom 0.508: v17.46,39.1 16.51,38.15
  other vias: 21.61,39.5 23.01,39.5
  pour PWR: 17.01,32.5 18.41,31.1 23.36,31.1 23.36,27 20.51,27 16.51,31 16.51,32
  pour PWR: 18.37,31.05 23.36,31.05 23.36,27.15 23.51,27 20.51,27
  pour Top: 21.51,42.5 23.01,42.5 24.01,41.5 24.01,39 20.71,39 20.71,41.5
  pour PWR: 9.41,41.65 9.41,35.95 12.16,33.2 12.16,30.8 16.71,30.8 20.71,26.8 23.56,26.8 23.56,31.15 18.66,31.15 17.26,32.55 17.21,32.55 17.21,36.45 17.26,36.45 19.46,38.65 27.01,38.65 27.16,38.8 27.16,41.65
+3V3_D  (via drill 0.4, 0.41, 0.5)
  Top 0.305: v19.31,25 R6.2 | R5.2 v18.51,27.5 | v7.01,35.5 7.26,35.25 U3.28 | R7.2 13.31,23.3 | C8.1 18.91,24 21.71,24 R19.1 | U1.2 v15.01,14.96
  Top 0.406: FB1.2 18.51,43.95 v18.56,44
  Top 0.508: U1.2 U1.4 | v12.56,22.35 12.56,22.55 13.31,23.3
  Bottom 0.254: R36.1 26.26,46.95 v25.96,46.65
  Bottom 0.305: R21.1 v31.41,46.2 | R20.2 v14.56,43.95 | v7.01,35.5 C20.1 | R15.1 v20.41,15.5 | v24.71,25.95 24.71,25.35 R16.1 | R22.1 32.01,23 v31.01,22 | v15.01,14.96 15.68,14.3 D9.2 | R35.1 30.66,47.9 30.01,47.24 v30.01,46.84
  Bottom 0.406: v18.56,44 C27.1
  other vias: 10.31,22.3 11.46,22.3
  pour Top: 9.81,22.85 9.81,21.7 18.36,21.7 18.36,23.45 12.01,23.45 11.41,22.85
  pour PWR: 0.06,0.1 27.66,0.1 27.66,19 16.66,30 9.01,30 8.91,30.1 8.91,42.1 32.01,42.1 32.01,47.5 10.01,47.5 10.01,46.75 6.26,43 0.06,43
  pour Top: 8.66,20.65 8.66,18.35 9.01,18 10.71,18 10.71,22.85 9.86,22.85 9.81,22.8 9.81,21.8
  pour PWR: 22.01,0.05 45.51,0.05 45.51,22 44.51,23 22.01,23
  pour PWR: 20.01,26.25 20.01,22 27.01,22 27.01,26.25
  pour PWR: 7.51,34.5 9.96,34.5 11.76,32.7 11.76,18 7.51,18
+5V  (via drill 0.41, 0.5)
  Top 0.254: U1.3 18.09,16.43 v18.51,16
  Top 0.508: U1.3 17.31,17.55 v16.96,17.9 | v6.46,16 6.46,14.67 6.51,14.62
  Top 1.27: J1.3 3.82,13.42 5.01,14.62 6.51,14.62 F1.2
  Bottom 0.254: v18.51,16 19.44,15.07 D9.1
  Bottom 0.305: R18.1 5.46,17 v6.46,16
  Bottom 0.406: v6.46,16 6.49,16.02
  Bottom 0.508: v16.96,17.9 15.96,16.9 C16.1 11.82,16.9 11.22,17.5 8.51,17.5 8.16,17.15 D2.2 6.49,16.02
+5V_PREFUSE
  Top 0.406: L1.2 11.01,9.15 11.01,13.3 11.66,13.95 23.86,13.95 25.11,15.2 U2.4
  Bottom 0.305: D4.A 12.06,4.8 8.78,4.8 C15.+
  pour Top (no thermals): 15.01,9.5 5.01,9.5 5.01,4 15.01,4
+24V  (via drill 0.41, 0.5)
  Top 0.305: 37.44,20.73 v37.41,20.75
  Top 0.406: U4.7 37.44,20.73
  Top 1.016: C30.1 v33.01,22
  other vias: 41.11,20.8 42.66,20.8 42.26,22.2 43.66,22.2
  pour Top (no thermals): 40.51,18.65 40.51,21.8 43.31,21.8 43.31,20.35 41.61,18.65
  pour GND: 33.01,33.5 31.61,33.5 27.51,29.4 27.51,23.3 30.86,19.95 42.96,19.95 44.36,21.35 44.36,23 33.01,23
  pour Top (no thermals): 40.51,18.65 40.51,22.8 44.36,22.8 44.36,21.4 41.61,18.65
+24V_FILTERED
  pour Top: 28.36,10.75 28.36,5.5 33.31,5.5 33.31,7.6 31.76,7.6 31.41,7.95 31.41,10.75
+24V_FUSE  (via drill 0.5)
  Bottom 0.305: J1.1 2.61,18.5 2.61,19.65 2.11,20.15 R17.1
  Bottom 1.016: 2.15,2.87 2.41,2.6 | 1.11,3.9 1.01,4
  Bottom 1.27: J1.1 2.36,18.5 1.01,17.15 1.01,4 2.41,2.6 3.86,1.15 35.71,1.15 41.01,6.45 v41.01,7.5
  other vias: 41.01,6 41.01,9
  pour Top (no thermals): 38.01,7.7 38.01,5.45 41.66,5.45 42.06,5.85 42.06,14.2 42.01,14.25 40.46,14.25 40.46,12.65 40.11,12.3 40.11,8.1 39.71,7.7
  pour Bottom: 40.01,3.5 40.01,9.75 41.11,9.75 42.01,8.85 42.01,3.5
  pour Bottom: 0.61,5 3.01,5 3.01,2.5 2.01,2.5 0.61,3.9
ACTLED
  Top 0.254: U3.27 9.26,35.75 9.51,36 9.51,37 6.01,40.5 6.01,41.5 11.01,46.5 11.01,48 12.36,49.35 20.16,49.35 20.51,49 29.51,49 D7.C
AGND
  Top 1.016: J3.CH2 L3.2
  PWR 1.016: H1.B2,8 8.01,49.5 35.01,49.5 36.51,48 36.51,42.08 35.81,41.38 J3.CH2 35.81,42.38 41.01,42.38 H2.B2,8
  pour PWR: 45.51,23.5 33.21,23.5 33.21,43 45.51,43
CT
  Bottom 0.254: J3.5 31.51,33.6 29.56,31.65 26.81,31.65 C21.1 25.26,30.85 24.16,29.75 R24.1
DUPLED  (via drill 0.4)
  Top 0.254: U3.26 7,36.25 6.16,37.09 v6.16,38.75 | v12.11,44.6 13.11,44.6 14.2,45.69 18.85,45.69 20.91,47.75 26.26,47.75 D8.C
  Bottom 0.254: v6.16,38.75 6.16,39.65 6.86,40.35 7.96,40.35 8.61,41 8.61,42.1 11.11,44.6 v12.11,44.6
G_LED+
  Bottom 0.254: J3.L1 R22.2
GND  (via drill 0.41, 0.5, 0.6, 0.8)
  Top 0.254: U3.14 14.76,37.6 | U3.16 13.76,37.65 | U3.19 12.26,37.65 | U3.48 15.26,29.25 | R9.2 8.66,42.25 7.86,41.45 v7.61,41.45 | R4.1 21.81,37.9 v22.96,37.9 | C22.2 24.96,33.6 v24.96,32.3 | R12.2 6.36,25 v5.51,24.15 | R10.2 v5.51,27.5 | R14.2 5.81,22.45 v5.51,22.75 | C6.2 v2.41,29.15 | C2.2 v3.51,40 | X1.2 4.4,33.69 v4.8,34.09 | X1.4 2.41,36.1 v2.01,36.5 | U3.29 v9.61,34.75
  Top 0.305: U3.9 15.86,35.25 v15.31,35.8 | 14.76,37.6 v14.76,36.8 | 13.76,37.65 13.76,36.85 v13.71,36.8 | 12.26,37.65 v12.26,36.75 | v15.86,28.85 15.66,28.85 15.26,29.25 | C4.2 v14.81,42.2 | C5.2 v13.26,42.2 | C7.2 10.91,42 v10.71,42.2 | C9.2 v19.81,37.9 | U3.3 15.86,32.25 v15.36,31.75 | v2.01,23.46 2.56,22.91 D3.C | D5.C 1.93,26.84 v1.93,27.3 | D6.C 22.56,21.5 v21.56,20.5 | S1.1.1 v12.76,48.3 | S1.1.2 v19.16,48.3
  Top 0.406: R1.2 v19.81,17.3 | C8.2 19.38,22.77 v20.58,22.77 | U4.9 36.79,13.07 36.37,12.66 v35.92,12.66
  Top 0.508: v9.91,11.8 C23.2
  Top 1.016: L3.1 v34.81,47 | C30.2 v33.01,18
  Bottom 0.254: C10.2 v12.11,43.4 | R11.2 v5.01,25.5 | v5.51,22.75 R13.2 | C21.2 v27.01,29.15 | v26.51,23 26.51,22.8 C26.1
  Bottom 0.305: R27.2 4.71,7.35 3.72,8.34 J1.5 | v10.66,16.5 R28.2 | C20.2 v5.31,37.66 | C17.2 17.41,44.95 v16.46,44.95
  Bottom 0.406: C19.2 40.31,1.9 v40.01,1.9 | C27.2 21.86,44.7 v21.51,45.05
  Bottom 0.508: v15.96,19.4 15.91,19.4 C16.2
  other vias: 13.06,35.25 19.96,32.05 20.21,34.85 29.16,11.8 26.86,11.8 30.01,17.05 28.71,17.05 31.01,12.5 12.76,18.31 12.76,19.35 12.76,20.45 21.51,46.5 23.01,46.5 13.01,32 11.81,34.7 26.86,13.25 28.01,13.25 29.16,13.25 28.01,11.8 30.71,4.25 29.21,2.75 30.71,2.75
  pour Top (no thermals): 26.01,11.3 31.76,11.3 31.76,18 28.01,18 28.01,14 26.01,14
  pour Top: 12.01,21 12.01,15 13.51,15 13.51,21
  pour PWR: 18.51,36.7 18.51,32.1 18.81,31.8 29.21,31.8 32.51,35.1 32.51,38.1 19.91,38.1
  pour Top: 21.56,43.35 23.11,43.35 23.71,43.95 23.71,47 21.01,47 21.01,43.9
  pour GND: 0.01,0 0.01,50.5 45.51,50.5 45.51,43 33.01,43 33.01,35.5 27.01,29.5 27.01,23 30.51,19.5 45.51,19.5 45.51,0
  pour Bottom: 9.01,37.45 9.01,34.5 12.86,30.65 17.11,30.65 17.11,36.9 17.01,37 15.51,37 15.06,37.45
  pour Bottom: 26.46,13.65 26.46,11.35 29.61,11.35 29.61,13.65
  pour Bottom: 12.01,20.91 12.01,17.87 13.51,17.87 13.51,20.91
  pour Top: 28.51,5.2 28.51,2 31.26,2 31.26,5.2
LINKLED  (via drill 0.4)
  Top 0.254: v7.31,37.85 7.31,37.1 7.66,36.75 U3.25
  Bottom 0.254: J3.L2 42.44,30.07 31.01,41.5 18.61,41.5 16.06,38.95 15.31,38.95 14.21,37.85
  Bottom 0.305: 14.21,37.85 v7.31,37.85
MISO  (via drill 0.35)
  Top 0.207: v6.96,29.4 5.76,30.6 5.76,31.5 6.51,32.25 U3.34
  Bottom 0.207: v6.96,29.4 11.31,29.4 19.46,21.25 21.96,21.25 25.21,18 31.51,18 32.51,17 35.51,17 36.51,18 39.96,18 41.13,16.84 41.13,15.89 43.59,13.42 J2.3
MOSI  (via drill 0.35)
  Top 0.207: U3.35 7.31,31.75 7.01,31.45 7.01,30.95 7.61,30.35 v8.51,30.35
  Bottom 0.207: v8.51,30.35 12.26,30.35 18.96,23.65 21.66,23.65 25.66,19.65 37.76,19.65 38.46,18.95 40.66,18.95 J2.2
N$1
  Top 0.254: U3.23 10.26,39 R9.1
N$2
  Top 0.254: U3.38 10.26,29.05 9.61,28.4 9.26,28.4 R10.1
N$3  (via drill 0.41)
  Top 0.254: U3.39 10.76,28.75 9.41,27.4 v9.41,26.1
  Bottom 0.254: v9.41,26.1 8.81,25.5 R11.1
N$4
  Top 0.254: U3.45 13.76,29.05 14.31,28.5 14.66,28.5 R5.1
N$5
  Top 0.254: U3.44 13.26,28.6 13.94,27.93 14.29,27.93 14.66,27.55 14.66,26.85 15.66,25.85 R6.1
N$6
  Top 0.254: U3.40 11.26,28.25 10.21,27.2 10.21,25.5 9.71,25 R12.1
N$7
  Top 0.254: U3.43 12.76,28.3 13.31,27.75 R7.1
N$8
  Bottom 0.254: J3.9 R29.2
N$9  (via drill 0.41)
  Top 0.254: 40.02,19.37 40.02,20.36 39.68,20.7 v39.66,20.7 39.26,21.1 R30.2 38.21,22.3 37.91,22.6 R31.1
  Top 0.406: U4.3 40.02,19.37
N$10
  Bottom 0.254: J3.10 28.97,25.49 R3.2
N$11
  Top 0.254: U3.31 7.56,33.75 7.16,33.35 R2.1 4.96,33.35 3.56,31.95 C6.1 X1.3
N$12
  Bottom 0.254: R29.1 30.86,24 29.26,24 R3.1 C26.2
N$13
  Top 0.254: U3.30 7.56,34.25 7.16,34.65 R2.2 5.2,35.31 X1.1 3.61,37.05 C2.1
N$15
  Top 0.508: C13.1 25.56,8.26 26.11,8.8 U2.5
N$16
  Top 0.406: C1.2 R1.1
N$17
  Top 0.406: U2.3 27.33,15.25 27.33,16.98 C1.1
N$18  (via drill 0.41)
  Top 0.254: U3.22 v10.76,36.95
  Bottom 0.254: v10.76,36.95 C11.1
N$19  (via drill 0.41)
  Top 0.254: U3.20 11.76,39.15 v12.06,39.45
  Bottom 0.254: v12.06,39.45 12.06,40.55 C10.1
N$20  (via drill 0.41)
  Top 0.254: U3.41 11.76,27.85 10.91,27 10.91,24.9 v10.51,24.5
  Bottom 0.254: v10.51,24.5 8.76,22.75 R13.1
N$21
  Top 0.254: R4.2 21.46,35.85 18.96,35.85 18.86,35.75 U3.10
N$22
  Top 0.254: U3.42 12.26,27.4 11.61,26.75 11.61,24.45 10.81,23.65 9.56,23.65 R14.1
N$23
  Bottom 0.305: D4.C 12.51,7.4 11.01,8.9 Q1.2
N$24
  Bottom 0.305: Q1.1 D2.1 8.91,12.57 9.99,13.65 R28.1
N$25
  Bottom 0.305: R27.1 7.11,8.05 5.76,9.4 Q1.3
N$27
  Top 0.254: U4.5 38.74,20.57 37.81,21.51 36.82,21.51 R32.1 R31.2
N$28
  Top 0.305: C3.1 33.01,11.5 33.66,10.85 38.21,10.85 38.76,11.39 38.76,13.43
  Top 0.406: 38.76,13.43 U4.12
N$33
  Top 0.305: U4.11 38.14,13.4 38.14,11.78 37.81,11.45 35.66,11.45 34.86,12.25 34.86,13.1 35.21,13.45 R33.1
RD_N
  Bottom 0.16: J3.4 28.97,36.03 28.51,36.5 26.26,36.5 26.01,36.25 26.01,34.32 25.13,33.44 23.04,33.44 22.81,33.2 22.51,32.91 C25.2
RD_P
  Bottom 0.16: J3.3 31.38,36.81 26.13,36.81 25.7,36.38 25.7,34.45 25,33.75 23.01,33.75 22.51,34.25 22.51,34.26
  Bottom 0.203: 22.51,34.26 C24.2
RTN  (via drill 0.41, 0.5)
  Top 0.406: U4.17 38.61,16.4 38.01,17 | 36.79,18.23 38.01,17 | U4.6 38.09,17.07 38.01,17
  Top 0.45: U4.8 36.79,18.23
  PWR 0.305: v34.11,16.15 34.11,12.46 v33.91,12.25
  Bottom 0.305: R34.2 34.26,11.89 v33.91,12.25
  other vias: 37.51,17 37.51,15.5 39.01,17 39.01,15.5
  pour Top: 32.51,15.4 35.81,15.4 36.51,14.7 41.51,14.7 41.56,14.75 41.56,18.35 36.31,18.35 35.96,18.7 34.61,18.7 32.51,16.6
  pour Bottom: 37.01,17.5 37.01,15 39.51,15 39.51,17.5
RX_FILTER  (via drill 0.41)
  Top 0.254: v23.75,32.05 23.21,32.59 C22.1 23.21,34.85 v23.71,35.35
  Bottom 0.254: R26.2 v23.75,32.04 v23.75,32.05 | R25.2 v23.71,35.35
RX_N  (via drill 0.3)
  Top 0.16: v19.51,33.2 19.27,33.44 17.51,33.44 17.3,33.23 16.78,33.23
  Top 0.203: 16.78,33.23 U3.5
  Bottom 0.16: v19.51,33.2 19.76,33.44 20.69,33.44 21.21,32.92 C25.1
  Bottom 0.254: C25.1 R26.1
RX_P  (via drill 0.3)
  Top 0.16: v19.51,34 19.27,33.76 U3.6
  Bottom 0.16: v19.51,34 19.76,33.76 20.81,33.76 21.21,34.16 C24.1
  Bottom 0.254: R25.1 C24.1
SCLK  (via drill 0.35)
  Top 0.207: U3.33 9.26,32.75 9.51,32.5 v11.06,32.5
  Bottom 0.207: v11.06,32.5 8.26,32.5 5.78,30.02 5.78,28.83 6.36,28.25 10.56,28.25 18.86,19.95 21.01,19.95 25.26,15.7 31.21,15.7 31.81,15.1 35.61,15.1 36.16,14.55 39.96,14.55 43.63,10.88
  Bottom 0.254: J2.4 43.63,10.88
SPDLED  (via drill 0.41)
  Top 0.254: v8.86,39.15 9.36,39.15 9.76,38.75 U3.24
  Bottom 0.254: J3.L4 39.14,37 37.01,37 31.41,42.6 16.96,42.6 13.01,38.65 9.86,38.65 9.36,39.15 v8.86,39.15
TX_N
  Top 0.16: U3.1 17.76,31.25 18.51,30.5 18.51,29.86 19.29,29.08 20.01,29.08 | 20.01,29.08 24.03,29.08 26.83,31.87 26.83,38.81 27.51,39.5 29.26,39.5 29.61,39.15 29.61,38.59 J3.2 | R8.2 19.96,29.03 20.01,29.08
TX_P
  Top 0.16: U3.2 17.71,31.75 18.83,30.63 18.83,29.99 19.41,29.4 21.01,29.4 | 21.01,29.4 23.91,29.4 26.51,32 26.51,38.94 27.38,39.81 29.39,39.81 29.98,39.22 J3.1 | R23.1 21.21,29.6 21.01,29.4
Y_LED+
  Bottom 0.254: J3.L3 35.71,45 R21.2

### Text on the board
tPlace: DUP | ACT | #3 | #3 | PoE | 5V | V2.0 | 24V | 3V3
bPlace: 5V BAD | RoboJackets / RoboRacing / July 2020